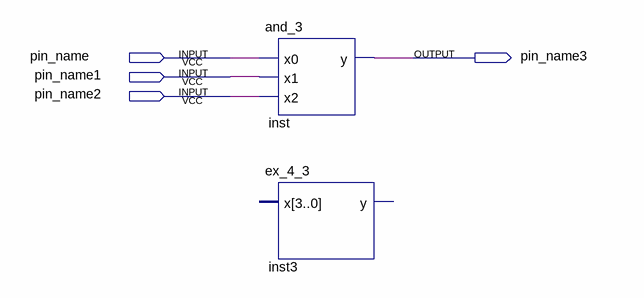
[diagram p0: schematic sheet]
// Quartus schematic main_test_1.bdf as structural Verilog: 2 symbols, 4 pins
module main_test_1 (
  input  pin_name,
  input  pin_name1,
  input  pin_name2,
  output pin_name3
);

  and_3 inst (.x0(pin_name), .x1(pin_name1), .x2(pin_name2), .y(pin_name3));
  ex_4_3 inst3 ();  // open: x, y
endmodule
